# Altium schematic sheet MCU.SchDoc
size 292 x 193 mm; Author: Power Lin; DocumentNumber: 2; SheetNumber: 2; SheetTotal: 4; Website: wiki-power.com
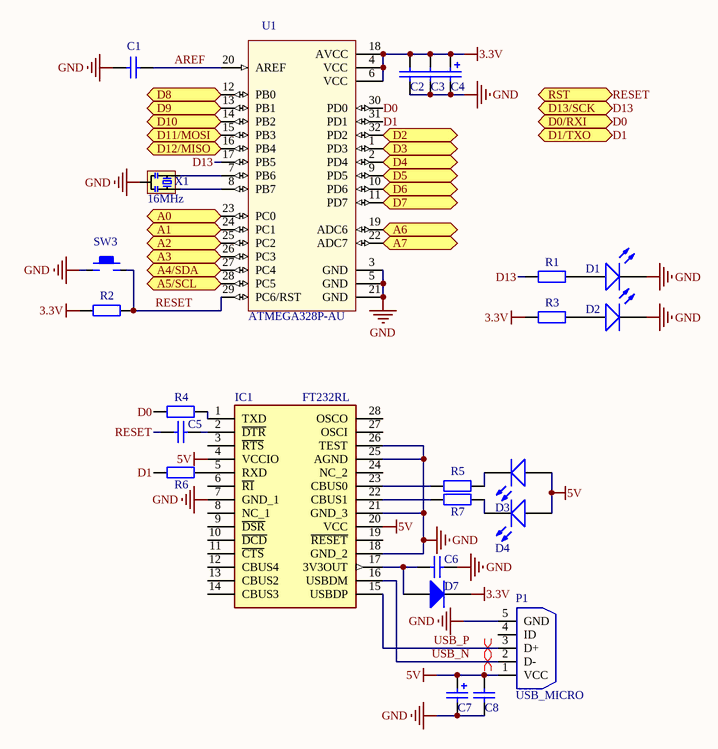
[diagram p0: MCU.SchDoc]

## Parts
C1  100nF  [CAP-0603]  (value not drawn)
C2  1uF  [CAP-0603]  (value not drawn)
C3  1uF  [CAP-0603]  (value not drawn)
C4  4.7uF 16V  [CAP-AUX-3216]  (value not drawn)
C5  100nF  [CAP-0603]  (value not drawn)
C6  100nF  [CAP-0603]  (value not drawn)
C7  4.7uF 16V  [CAP-AUX-3216]  (value not drawn)
C8  100nF  [CAP-0603]  (value not drawn)
D1  GREEN  [LED-0603]  (value not drawn)
D2  RED  [LED-0603]  (value not drawn)
D3  RED  [LED-0603]  (value not drawn)
D4  RED  [LED-0603]  (value not drawn)
D7  SS14  [SOD_123]  (value not drawn)
IC1  FT232RL  [SSOP]
P1  USB_MICRO  [Micro usb座 -全贴片]
R1  330R  [R-0603]  (value not drawn)
R2  1K  [R-0603]  (value not drawn)
R3  10K  [R-0603]  (value not drawn)
R4  1K  [R-0603]  (value not drawn)
R5  1K  [R-0603]  (value not drawn)
R6  1K  [R-0603]  (value not drawn)
R7  1K  [R-0603]  (value not drawn)
SW3  KEY  [KEY-4P-4.2*3.4*2.5]  (value not drawn)
U1  ATMEGA328P-AU  [TQFP-32_7x7x08P]
X1  16MHz  [CSTCE_G(A)村田晶振]

## Ports
A0 (bidir), A1 (bidir), A2 (bidir), A3 (bidir), A4/SDA (bidir), A5/SCL (bidir), A6 (bidir), A7 (bidir), D0/RXI (bidir), D1/TXO (bidir), D2 (bidir), D3 (bidir), D4 (bidir), D5 (bidir), D6 (bidir), D7 (bidir), D8 (bidir), D9 (bidir), D10 (bidir), D11/MOSI (bidir), D12/MISO (bidir), D13/SCK (bidir), RST (bidir)

## Nets
3.3V: C2.2 C3.2 C4.1 D7.2(K) R2.1 R3.1 U1.4(VCC) U1.6(VCC) U1.18(AVCC)
5V: C7.1 C8.2 D3.A D4.A IC1.4(VCCIO) IC1.20(VCC) P1.1(VCC)
GND: C1.1 C2.1 C3.1 C4.2 C6.1 C7.2 C8.1 D1.K D2.K IC1.7(GND_1) IC1.18(GND_2) IC1.21(GND_3) IC1.25(AGND) IC1.26(TEST) P1.5(GND) SW3.1 U1.3(GND) U1.5(GND) U1.21(GND) X1.2(GND)
A0: U1.23(PC0) ; port A0
A1: U1.24(PC1) ; port A1
A2: U1.25(PC2) ; port A2
A3: U1.26(PC3) ; port A3
A4/SDA: U1.27(PC4) ; port A4/SDA
A5/SCL: U1.28(PC5) ; port A5/SCL
A6: U1.19(ADC6) ; port A6
A7: U1.22(ADC7) ; port A7
AREF: C1.2 U1.20(AREF)
D0: R4.1 U1.30(PD0) ; port D0/RXI
D1: R6.1 U1.31(PD1) ; port D1/TXO
D2: U1.32(PD2) ; port D2
D3: U1.1(PD3) ; port D3
D4: U1.2(PD4) ; port D4
D5: U1.9(PD5) ; port D5
D6: U1.10(PD6) ; port D6
D7: U1.11(PD7) ; port D7
D8: U1.12(PB0) ; port D8
D9: U1.13(PB1) ; port D9
D10: U1.14(PB2) ; port D10
D11/MOSI: U1.15(PB3) ; port D11/MOSI
D12/MISO: U1.16(PB4) ; port D12/MISO
D13: R1.1 U1.17(PB5) ; port D13/SCK
RESET: C5.2 R2.2 SW3.2 U1.29(PC6/RST) ; port RST
USB_N: IC1.16(USBDM) P1.2(D-)
USB_P: IC1.15(USBDP) P1.3(D+)
NetC5_1: C5.1 IC1.2(~{DTR})
NetC6_2: C6.2 D7.1(A) IC1.17(3V3OUT)
NetD1_A: D1.A R1.2
NetD2_A: D2.A R3.2
NetD3_K: D3.K R5.2
NetD4_K: D4.K R7.2
NetIC1_1: IC1.1(TXD) R4.2
NetIC1_5: IC1.5(RXD) R6.2
NetIC1_22: IC1.22(CBUS1) R7.1
NetIC1_23: IC1.23(CBUS0) R5.1
NetU1_7: U1.7(PB6) X1.1(OSC1)
NetU1_8: U1.8(PB7) X1.3(OSC2)

Not connected (* = marked no-connect by the designer): IC1 3(~{RTS}) 6(~{RI}) 8(NC_1) 9(~{DSR}) 10(~{DCD}) 11(~{CTS}) 12(CBUS4) 13(CBUS2) 14(CBUS3) 19(~{RESET}) 24(NC_2) 27(OSCI) 28(OSCO); P1 4(ID)

## Layout directives
differential pair: USB_N, USB_P

## Notes on the sheet
- Author
- DocumentName
- ModifiedDate
- ProjectName
- SheetNumber
- SheetTotal
- Website
- Revision

## Library data of the parts
C1-C3 C5 C6 C8 = CAP: 贴片电容; ComponentLink1Description: 供应商链接; ComponentLink1URL: http://www.szlcsc.com/product/details_53938.html; Package: 0402; Supplier: LC; SuppliersPartNumber: C52923
C4 C7 = CAP-POL: 贴片电容-有极性; ComponentLink1Description: 供应商链接; ComponentLink1URL: http://www.szlcsc.com/product/details_16815.html; Package: 3528; Supplier: LC; SuppliersPartNumber: C16133
D1-D4 = LED: 发光二极管; pin to pad: A>1 K>2; ComponentLink1Description: 供应商链接; ComponentLink1URL: http://www.szlcsc.com/product/details_2663.html; Package: 0603; Supplier: LC; SuppliersPartNumber: C2290
D7 = DIODE: 二极管; ComponentLink1Description: 供应商链接; ComponentLink1URL: http://www.szlcsc.com/product/details_23178.html; Package: SMA(DO-214AC); Supplier: LC; SuppliersPartNumber: C22452
IC1 = FT232RL: USB to UART; Manufacturer_Name: FTDI Chip; Datasheet Link: http://www.ftdichip.com/Support/Documents/DataSheets/ICs/DS_FT232R.pdf; Height: 2mm; Manufacturer_Part_Number: FT232RL; RS Part Number: 0406580P; RS Price/Stock: http://uk.rs-online.com/web/p/products/0406580P
P1 = USB_MICRO: USB 接口
R1-R7 = RES: 贴片电阻; Package: 0805; Supplier: LC; SuppliersPartNumber: C17798
SW3 = KEY: 按键开关
U1 = ATMEGA328P-AU: 微控制器, 8 Bit, Atmega, 20mhz, Tqfp-32; MF: Microchip; SnapEDA_Link: https://www.snapeda.com/parts/ATMEGA328P-AU/Microchip/view-part/?ref=snap; Availability: Unavailable; Price: None; MP: ATMEGA328P-AU; Package: TQFP-32 Microchip; Value: *
X1 = XTAL: 有源晶振